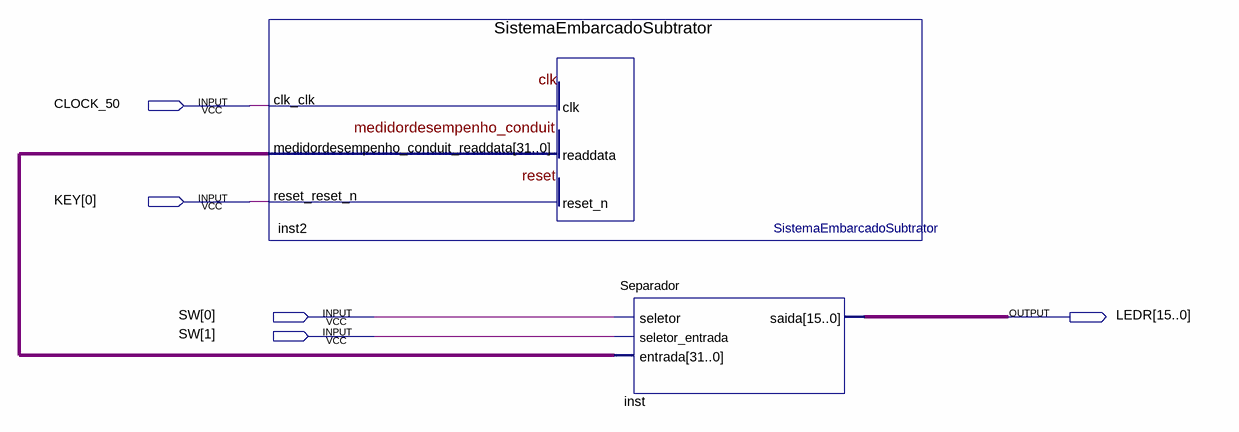
[diagram p0: schematic sheet]
// Quartus schematic TestePlatSub.bdf as structural Verilog: 2 symbols, 5 pins
module TestePlatSub (
  input  CLOCK_50,
  input  [0:0] KEY,
  input  [1:0] SW,
  output [15:0] LEDR
);

  wire [31:0] inst2_medidordesempenho_conduit_readdata;

  SistemaEmbarcadoSubtrator inst2 (
    .clk_clk(CLOCK_50), .reset_reset_n(KEY[0]),
    .medidordesempenho_conduit_readdata(inst2_medidordesempenho_conduit_readdata));
  Separador inst (
    .seletor(SW[0]), .seletor_entrada(SW[1]), .entrada(inst2_medidordesempenho_conduit_readdata), .saida(LEDR));
endmodule
